# EasyEDA Pro project NAND-7S.eprj, board PCB1
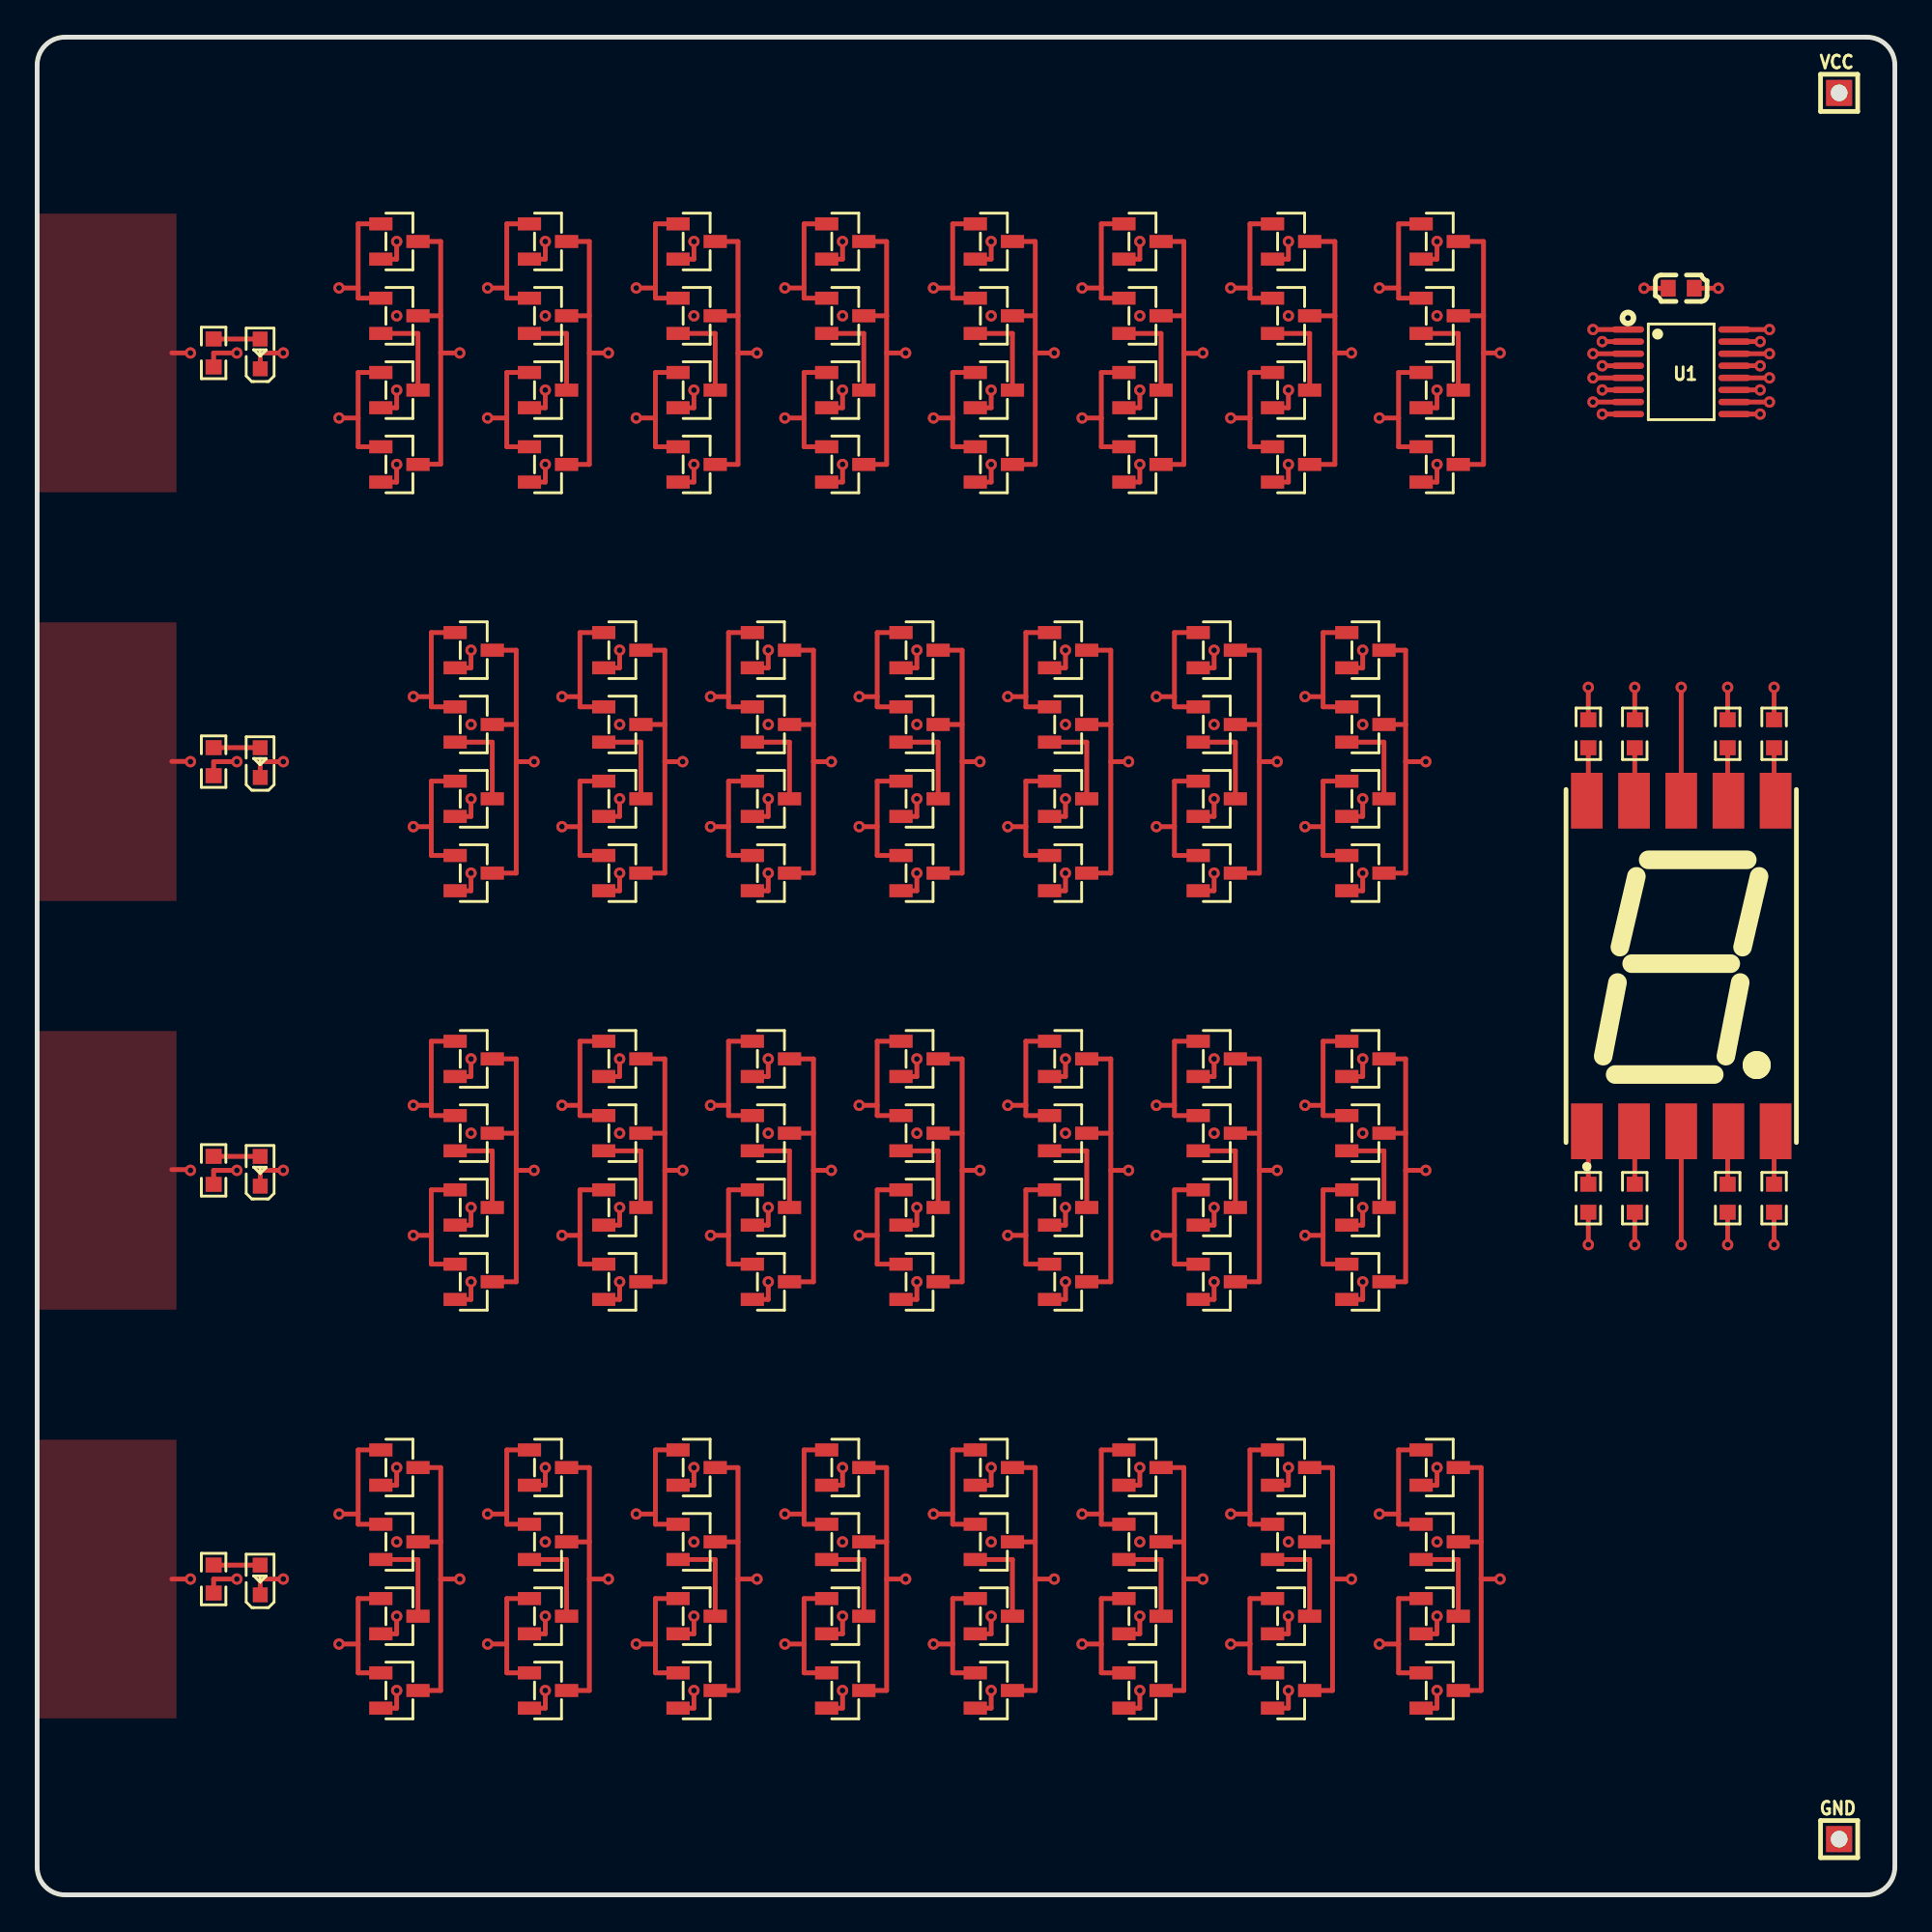
[diagram p1: board, top side]
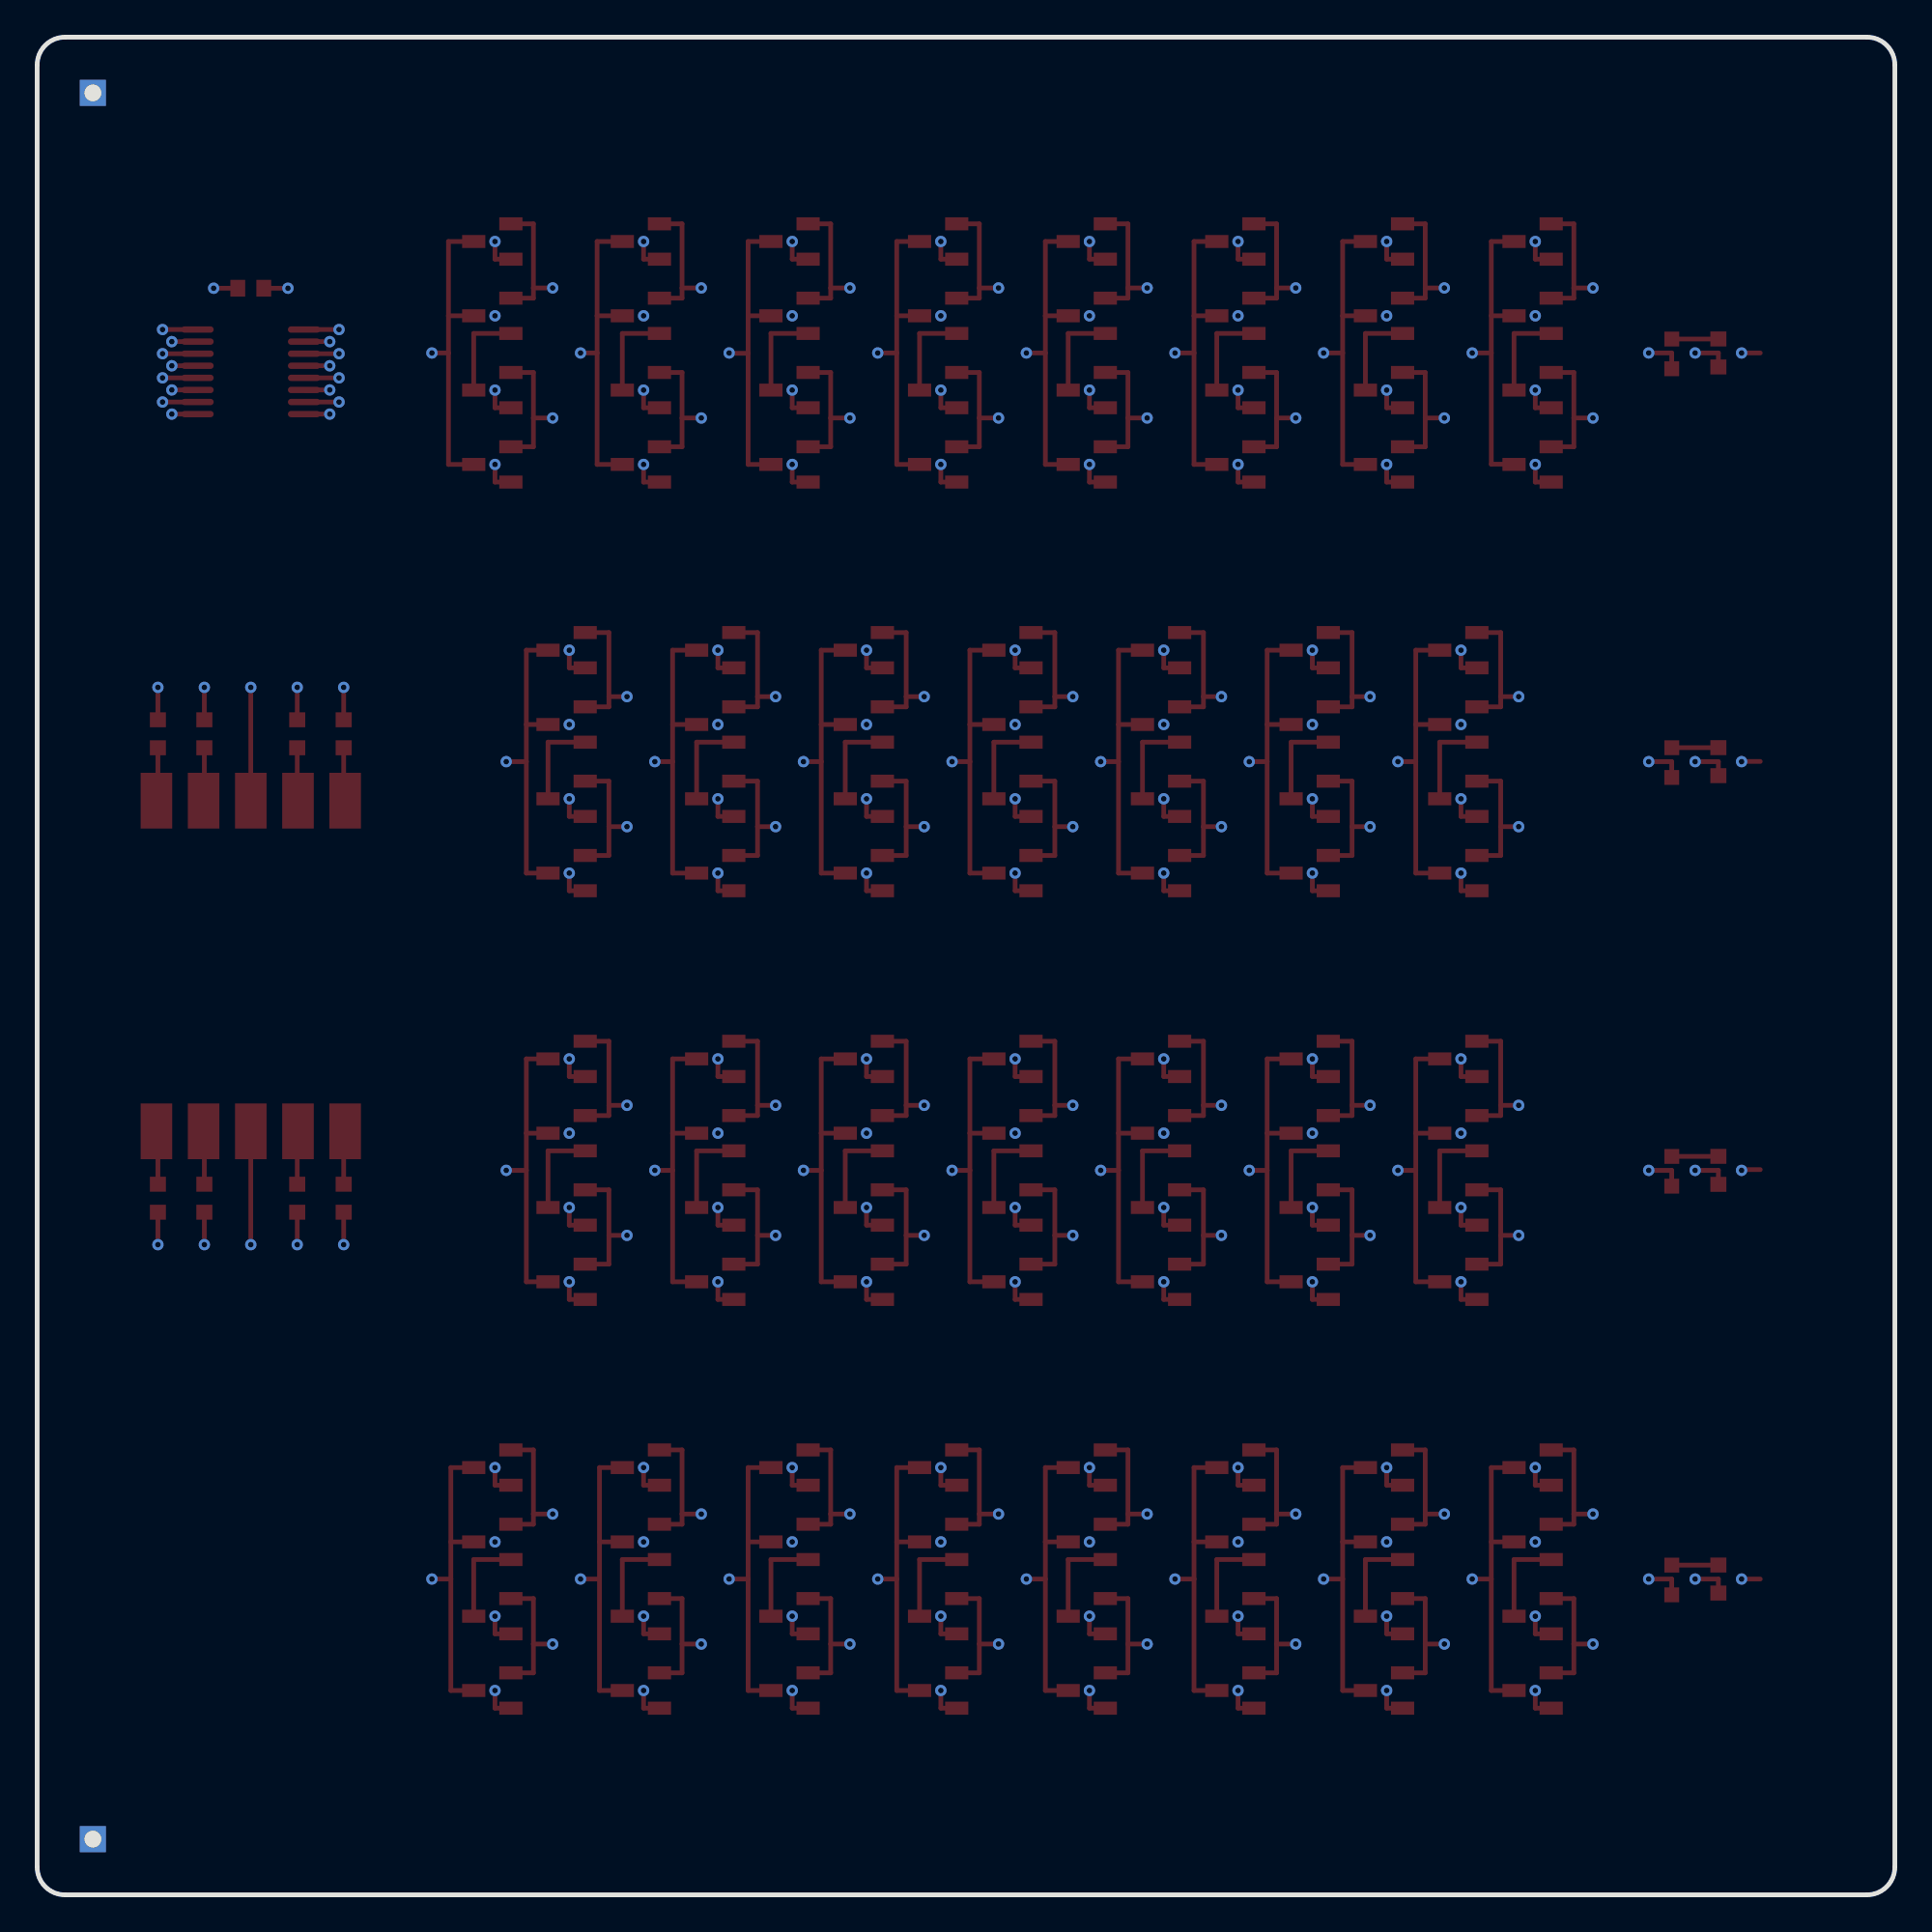
[diagram p2: board, bottom side, seen from below]

Outline 100 x 100 mm; copper layers: Top Layer, Inner1, Inner2, Inner3, Inner4, Bottom Layer. Coordinates in mm from the lower left corner of the outline.
Outline path: 0,98.5 0,1.5 arc(0.44,0.44) 1.5,0 98.5,0 arc(99.56,0.44) 100,1.5 100,98.5 arc(99.56,99.56) 98.5,100 1.5,100 arc(0.44,99.56) 0,98.5
Stack: Top Layer 0.035mm 外层铜厚1oz / Dielectric1 0.0994mm 3313 RC57% 4.2mil / Inner1 0.0152mm 内层铜厚 / Dielectric2 0.55mm 0.55mm H/H No copper / Inner2 0.0152mm 内层铜厚 / Dielectric3 0.1088mm 2116 RC54% 4.9mil / Inner3 0.0152mm 内层铜厚 / Dielectric4 0.55mm 0.55mm H/H No copper / Inner4 0.0152mm 内层铜厚 / Dielectric5 0.0994mm 3313 RC57% 4.2mil / Bottom Layer 0.035mm 外层铜厚1oz

## Design rules (mm)
template: JLCPCB Capability(Two Layers Board)
spacing copperThickness1oz (default): track to track 0.102, other pairs 0.152 to 0.3
spacing copperThickness2oz: track to track 0.203, other pairs 0.152 to 0.3
track width copperThickness1oz (default): min 0.127, default 0.254, max 2.54
track width copperThickness2oz: min 0.203, default 0.254, max 2.54
differential pair differentialPair (default): width min 0.127, default 0.254, max 2.54; gap min 0.152, default 0.152
via viaSize (default): diameter min 0.5, default 0.61, max 10; hole min 0.3, default 0.305, max 6.3

## Placement (name value [footprint] x y rotation side)
C1  100nF  [C0603]  88.5 86.48 180 top
GND  GND  [HDR-TH_1P-V-M_XKB_X4611WV-01I-C28D40]  97 3 0 top
LED1  -  [LED_0603]  12 83 90 top
LED2  -  [LED_0603]  12 61 90 top
LED3  -  [LED_0603]  12 39 90 top
LED4  -  [LED_0603]  12 17 90 top
N1-1  CJ2304  [SOT-23-3_L2.9-W1.3-P1.90-LS2.4-BR]  19.5 85 180 top
N1-2  CJ2304  [SOT-23-3_L2.9-W1.3-P1.90-LS2.4-BR]  19.5 81 180 top
N2-1  CJ2304  [SOT-23-3_L2.9-W1.3-P1.90-LS2.4-BR]  19.5 19 180 top
N2-2  CJ2304  [SOT-23-3_L2.9-W1.3-P1.90-LS2.4-BR]  19.5 15 180 top
N3-1  CJ2304  [SOT-23-3_L2.9-W1.3-P1.90-LS2.4-BR]  23.5 63 180 top
N3-2  CJ2304  [SOT-23-3_L2.9-W1.3-P1.90-LS2.4-BR]  23.5 59 180 top
N4-1  CJ2304  [SOT-23-3_L2.9-W1.3-P1.90-LS2.4-BR]  23.5 41 180 top
N4-2  CJ2304  [SOT-23-3_L2.9-W1.3-P1.90-LS2.4-BR]  23.5 37 180 top
N5-1  CJ2304  [SOT-23-3_L2.9-W1.3-P1.90-LS2.4-BR]  27.5 85 180 top
N5-2  CJ2304  [SOT-23-3_L2.9-W1.3-P1.90-LS2.4-BR]  27.5 81 180 top
N6-1  CJ2304  [SOT-23-3_L2.9-W1.3-P1.90-LS2.4-BR]  27.5 19 180 top
N6-2  CJ2304  [SOT-23-3_L2.9-W1.3-P1.90-LS2.4-BR]  27.5 15 180 top
N7-1  CJ2304  [SOT-23-3_L2.9-W1.3-P1.90-LS2.4-BR]  31.5 63 180 top
N7-2  CJ2304  [SOT-23-3_L2.9-W1.3-P1.90-LS2.4-BR]  31.5 59 180 top
N8-1  CJ2304  [SOT-23-3_L2.9-W1.3-P1.90-LS2.4-BR]  31.5 41 180 top
N8-2  CJ2304  [SOT-23-3_L2.9-W1.3-P1.90-LS2.4-BR]  31.5 37 180 top
N9-1  CJ2304  [SOT-23-3_L2.9-W1.3-P1.90-LS2.4-BR]  35.5 85 180 top
N9-2  CJ2304  [SOT-23-3_L2.9-W1.3-P1.90-LS2.4-BR]  35.5 81 180 top
N10-1  CJ2304  [SOT-23-3_L2.9-W1.3-P1.90-LS2.4-BR]  35.5 19 180 top
N10-2  CJ2304  [SOT-23-3_L2.9-W1.3-P1.90-LS2.4-BR]  35.5 15 180 top
N11-1  CJ2304  [SOT-23-3_L2.9-W1.3-P1.90-LS2.4-BR]  39.5 63 180 top
N11-2  CJ2304  [SOT-23-3_L2.9-W1.3-P1.90-LS2.4-BR]  39.5 59 180 top
N12-1  CJ2304  [SOT-23-3_L2.9-W1.3-P1.90-LS2.4-BR]  39.5 41 180 top
N12-2  CJ2304  [SOT-23-3_L2.9-W1.3-P1.90-LS2.4-BR]  39.5 37 180 top
N13-1  CJ2304  [SOT-23-3_L2.9-W1.3-P1.90-LS2.4-BR]  43.5 85 180 top
N13-2  CJ2304  [SOT-23-3_L2.9-W1.3-P1.90-LS2.4-BR]  43.5 81 180 top
N14-1  CJ2304  [SOT-23-3_L2.9-W1.3-P1.90-LS2.4-BR]  43.5 19 180 top
N14-2  CJ2304  [SOT-23-3_L2.9-W1.3-P1.90-LS2.4-BR]  43.5 15 180 top
N15-1  CJ2304  [SOT-23-3_L2.9-W1.3-P1.90-LS2.4-BR]  47.5 63 180 top
N15-2  CJ2304  [SOT-23-3_L2.9-W1.3-P1.90-LS2.4-BR]  47.5 59 180 top
N16-1  CJ2304  [SOT-23-3_L2.9-W1.3-P1.90-LS2.4-BR]  47.5 41 180 top
N16-2  CJ2304  [SOT-23-3_L2.9-W1.3-P1.90-LS2.4-BR]  47.5 37 180 top
N17-1  CJ2304  [SOT-23-3_L2.9-W1.3-P1.90-LS2.4-BR]  51.5 85 180 top
N17-2  CJ2304  [SOT-23-3_L2.9-W1.3-P1.90-LS2.4-BR]  51.5 81 180 top
N18-1  CJ2304  [SOT-23-3_L2.9-W1.3-P1.90-LS2.4-BR]  51.5 19 180 top
N18-2  CJ2304  [SOT-23-3_L2.9-W1.3-P1.90-LS2.4-BR]  51.5 15 180 top
N19-1  CJ2304  [SOT-23-3_L2.9-W1.3-P1.90-LS2.4-BR]  55.5 63 180 top
N19-2  CJ2304  [SOT-23-3_L2.9-W1.3-P1.90-LS2.4-BR]  55.5 59 180 top
N20-1  CJ2304  [SOT-23-3_L2.9-W1.3-P1.90-LS2.4-BR]  55.5 41 180 top
N20-2  CJ2304  [SOT-23-3_L2.9-W1.3-P1.90-LS2.4-BR]  55.5 37 180 top
N21-1  CJ2304  [SOT-23-3_L2.9-W1.3-P1.90-LS2.4-BR]  59.5 85 180 top
N21-2  CJ2304  [SOT-23-3_L2.9-W1.3-P1.90-LS2.4-BR]  59.5 81 180 top
N22-1  CJ2304  [SOT-23-3_L2.9-W1.3-P1.90-LS2.4-BR]  59.5 19 180 top
N22-2  CJ2304  [SOT-23-3_L2.9-W1.3-P1.90-LS2.4-BR]  59.5 15 180 top
N23-1  CJ2304  [SOT-23-3_L2.9-W1.3-P1.90-LS2.4-BR]  63.5 63 180 top
N23-2  CJ2304  [SOT-23-3_L2.9-W1.3-P1.90-LS2.4-BR]  63.5 59 180 top
N24-1  CJ2304  [SOT-23-3_L2.9-W1.3-P1.90-LS2.4-BR]  63.5 41 180 top
N24-2  CJ2304  [SOT-23-3_L2.9-W1.3-P1.90-LS2.4-BR]  63.5 37 180 top
N25-1  CJ2304  [SOT-23-3_L2.9-W1.3-P1.90-LS2.4-BR]  67.5 85 180 top
N25-2  CJ2304  [SOT-23-3_L2.9-W1.3-P1.90-LS2.4-BR]  67.5 81 180 top
N26-1  CJ2304  [SOT-23-3_L2.9-W1.3-P1.90-LS2.4-BR]  67.5 19 180 top
N26-2  CJ2304  [SOT-23-3_L2.9-W1.3-P1.90-LS2.4-BR]  67.5 15 180 top
N27-1  CJ2304  [SOT-23-3_L2.9-W1.3-P1.90-LS2.4-BR]  71.5 63 180 top
N27-2  CJ2304  [SOT-23-3_L2.9-W1.3-P1.90-LS2.4-BR]  71.5 59 180 top
N28-1  CJ2304  [SOT-23-3_L2.9-W1.3-P1.90-LS2.4-BR]  71.5 41 180 top
N28-2  CJ2304  [SOT-23-3_L2.9-W1.3-P1.90-LS2.4-BR]  71.5 37 180 top
N29-1  CJ2304  [SOT-23-3_L2.9-W1.3-P1.90-LS2.4-BR]  75.5 85 180 top
N29-2  CJ2304  [SOT-23-3_L2.9-W1.3-P1.90-LS2.4-BR]  75.5 81 180 top
N30-1  CJ2304  [SOT-23-3_L2.9-W1.3-P1.90-LS2.4-BR]  75.5 19 180 top
N30-2  CJ2304  [SOT-23-3_L2.9-W1.3-P1.90-LS2.4-BR]  75.5 15 180 top
P1-1  LP2301LT1G  [SOT-23-3_L2.9-W1.3-P1.90-LS2.4-BR]  19.5 89 180 top
P1-2  LP2301LT1G  [SOT-23-3_L2.9-W1.3-P1.90-LS2.4-BR]  19.5 77 180 top
P2-1  LP2301LT1G  [SOT-23-3_L2.9-W1.3-P1.90-LS2.4-BR]  19.5 23 180 top
P2-2  LP2301LT1G  [SOT-23-3_L2.9-W1.3-P1.90-LS2.4-BR]  19.5 11 180 top
P3-1  LP2301LT1G  [SOT-23-3_L2.9-W1.3-P1.90-LS2.4-BR]  23.5 67 180 top
P3-2  LP2301LT1G  [SOT-23-3_L2.9-W1.3-P1.90-LS2.4-BR]  23.5 55 180 top
P4-1  LP2301LT1G  [SOT-23-3_L2.9-W1.3-P1.90-LS2.4-BR]  23.5 45 180 top
P4-2  LP2301LT1G  [SOT-23-3_L2.9-W1.3-P1.90-LS2.4-BR]  23.5 33 180 top
P5-1  LP2301LT1G  [SOT-23-3_L2.9-W1.3-P1.90-LS2.4-BR]  27.5 89 180 top
P5-2  LP2301LT1G  [SOT-23-3_L2.9-W1.3-P1.90-LS2.4-BR]  27.5 77 180 top
P6-1  LP2301LT1G  [SOT-23-3_L2.9-W1.3-P1.90-LS2.4-BR]  27.5 23 180 top
P6-2  LP2301LT1G  [SOT-23-3_L2.9-W1.3-P1.90-LS2.4-BR]  27.5 11 180 top
P7-1  LP2301LT1G  [SOT-23-3_L2.9-W1.3-P1.90-LS2.4-BR]  31.5 67 180 top
P7-2  LP2301LT1G  [SOT-23-3_L2.9-W1.3-P1.90-LS2.4-BR]  31.5 55 180 top
P8-1  LP2301LT1G  [SOT-23-3_L2.9-W1.3-P1.90-LS2.4-BR]  31.5 45 180 top
P8-2  LP2301LT1G  [SOT-23-3_L2.9-W1.3-P1.90-LS2.4-BR]  31.5 33 180 top
P9-1  LP2301LT1G  [SOT-23-3_L2.9-W1.3-P1.90-LS2.4-BR]  35.5 89 180 top
P9-2  LP2301LT1G  [SOT-23-3_L2.9-W1.3-P1.90-LS2.4-BR]  35.5 77 180 top
P10-1  LP2301LT1G  [SOT-23-3_L2.9-W1.3-P1.90-LS2.4-BR]  35.5 23 180 top
P10-2  LP2301LT1G  [SOT-23-3_L2.9-W1.3-P1.90-LS2.4-BR]  35.5 11 180 top
P11-1  LP2301LT1G  [SOT-23-3_L2.9-W1.3-P1.90-LS2.4-BR]  39.5 67 180 top
P11-2  LP2301LT1G  [SOT-23-3_L2.9-W1.3-P1.90-LS2.4-BR]  39.5 55 180 top
P12-1  LP2301LT1G  [SOT-23-3_L2.9-W1.3-P1.90-LS2.4-BR]  39.5 45 180 top
P12-2  LP2301LT1G  [SOT-23-3_L2.9-W1.3-P1.90-LS2.4-BR]  39.5 33 180 top
P13-1  LP2301LT1G  [SOT-23-3_L2.9-W1.3-P1.90-LS2.4-BR]  43.5 89 180 top
P13-2  LP2301LT1G  [SOT-23-3_L2.9-W1.3-P1.90-LS2.4-BR]  43.5 77 180 top
P14-1  LP2301LT1G  [SOT-23-3_L2.9-W1.3-P1.90-LS2.4-BR]  43.5 23 180 top
P14-2  LP2301LT1G  [SOT-23-3_L2.9-W1.3-P1.90-LS2.4-BR]  43.5 11 180 top
P15-1  LP2301LT1G  [SOT-23-3_L2.9-W1.3-P1.90-LS2.4-BR]  47.5 67 180 top
P15-2  LP2301LT1G  [SOT-23-3_L2.9-W1.3-P1.90-LS2.4-BR]  47.5 55 180 top
P16-1  LP2301LT1G  [SOT-23-3_L2.9-W1.3-P1.90-LS2.4-BR]  47.5 45 180 top
P16-2  LP2301LT1G  [SOT-23-3_L2.9-W1.3-P1.90-LS2.4-BR]  47.5 33 180 top
P17-1  LP2301LT1G  [SOT-23-3_L2.9-W1.3-P1.90-LS2.4-BR]  51.5 89 180 top
P17-2  LP2301LT1G  [SOT-23-3_L2.9-W1.3-P1.90-LS2.4-BR]  51.5 77 180 top
P18-1  LP2301LT1G  [SOT-23-3_L2.9-W1.3-P1.90-LS2.4-BR]  51.5 23 180 top
P18-2  LP2301LT1G  [SOT-23-3_L2.9-W1.3-P1.90-LS2.4-BR]  51.5 11 180 top
P19-1  LP2301LT1G  [SOT-23-3_L2.9-W1.3-P1.90-LS2.4-BR]  55.5 67 180 top
P19-2  LP2301LT1G  [SOT-23-3_L2.9-W1.3-P1.90-LS2.4-BR]  55.5 55 180 top
P20-1  LP2301LT1G  [SOT-23-3_L2.9-W1.3-P1.90-LS2.4-BR]  55.5 45 180 top
P20-2  LP2301LT1G  [SOT-23-3_L2.9-W1.3-P1.90-LS2.4-BR]  55.5 33 180 top
P21-1  LP2301LT1G  [SOT-23-3_L2.9-W1.3-P1.90-LS2.4-BR]  59.5 89 180 top
P21-2  LP2301LT1G  [SOT-23-3_L2.9-W1.3-P1.90-LS2.4-BR]  59.5 77 180 top
P22-1  LP2301LT1G  [SOT-23-3_L2.9-W1.3-P1.90-LS2.4-BR]  59.5 23 180 top
P22-2  LP2301LT1G  [SOT-23-3_L2.9-W1.3-P1.90-LS2.4-BR]  59.5 11 180 top
P23-1  LP2301LT1G  [SOT-23-3_L2.9-W1.3-P1.90-LS2.4-BR]  63.5 67 180 top
P23-2  LP2301LT1G  [SOT-23-3_L2.9-W1.3-P1.90-LS2.4-BR]  63.5 55 180 top
P24-1  LP2301LT1G  [SOT-23-3_L2.9-W1.3-P1.90-LS2.4-BR]  63.5 45 180 top
P24-2  LP2301LT1G  [SOT-23-3_L2.9-W1.3-P1.90-LS2.4-BR]  63.5 33 180 top
P25-1  LP2301LT1G  [SOT-23-3_L2.9-W1.3-P1.90-LS2.4-BR]  67.5 89 180 top
P25-2  LP2301LT1G  [SOT-23-3_L2.9-W1.3-P1.90-LS2.4-BR]  67.5 77 180 top
P26-1  LP2301LT1G  [SOT-23-3_L2.9-W1.3-P1.90-LS2.4-BR]  67.5 23 180 top
P26-2  LP2301LT1G  [SOT-23-3_L2.9-W1.3-P1.90-LS2.4-BR]  67.5 11 180 top
P27-1  LP2301LT1G  [SOT-23-3_L2.9-W1.3-P1.90-LS2.4-BR]  71.5 67 180 top
P27-2  LP2301LT1G  [SOT-23-3_L2.9-W1.3-P1.90-LS2.4-BR]  71.5 55 180 top
P28-1  LP2301LT1G  [SOT-23-3_L2.9-W1.3-P1.90-LS2.4-BR]  71.5 45 180 top
P28-2  LP2301LT1G  [SOT-23-3_L2.9-W1.3-P1.90-LS2.4-BR]  71.5 33 180 top
P29-1  LP2301LT1G  [SOT-23-3_L2.9-W1.3-P1.90-LS2.4-BR]  75.5 89 180 top
P29-2  LP2301LT1G  [SOT-23-3_L2.9-W1.3-P1.90-LS2.4-BR]  75.5 77 180 top
P30-1  LP2301LT1G  [SOT-23-3_L2.9-W1.3-P1.90-LS2.4-BR]  75.5 23 180 top
P30-2  LP2301LT1G  [SOT-23-3_L2.9-W1.3-P1.90-LS2.4-BR]  75.5 11 180 top
R1  470  [R0603]  9.5 83 90 top
R2  470  [R0603]  9.5 61 90 top
R3  470  [R0603]  9.5 39 90 top
R4  470  [R0603]  9.5 17 90 top
R5  470  [R0603]  83.5 37.5 90 top
R6  470  [R0603]  86 37.5 90 top
R8  470  [R0603]  91 37.5 90 top
R9  470  [R0603]  93.5 37.5 90 top
R10  470  [R0603]  93.5 62.5 90 top
R11  470  [R0603]  91 62.5 90 top
R13  470  [R0603]  86 62.5 90 top
R14  470  [R0603]  83.5 62.5 90 top
U1  TTP224  [TSSOP-16_L5.0-W4.4-P0.65-LS6.4-BL]  88.5 81.98 270 top
U2  GS5611CR-G  [LED-SEG-SMD_GS5611CR-G]  88.5 50 0 top
VCC  VCC  [HDR-TH_1P-V-M_XKB_X4611WV-01I-C28D40]  97 97 0 top

## Footprints (pads in the part's own frame, mm; a bottom-side part is the same pattern mirrored in y, then rotated)
C0603
  rect 0.8x0.9 smd: 1(-0.7,0) 2(0.7,0)
HDR-TH_1P-V-M_XKB_X4611WV-01I-C28D40
  rect 1.4x1.4 hole 0.9: 1(0,0)
LED-SEG-SMD_GS5611CR-G
  rect 1.7x3 smd: 1(-5.08,-8.9) 2(-2.54,-8.9) 3(0,-8.9) 4(2.54,-8.9) 5(5.08,-8.9) 6(5.08,8.9) 7(2.54,8.9) 8(0,8.9) 9(-2.54,8.9) 10(-5.08,8.9)
LED_0603
  rect 0.8x0.8 smd: 1(-0.851,-0.01) 2(0.75,-0.005)
R0603
  rect 0.806x0.864 smd: 1(-0.753,0) 2(0.753,0)
SOT-23-3_L2.9-W1.3-P1.90-LS2.4-BR
  rect 1.25x0.7 smd: 1(1,-0.95) 2(1,0.95) 3(-1,0)
TSSOP-16_L5.0-W4.4-P0.65-LS6.4-BL
  oval 0.343x1.732 smd: 1(-2.276,-2.865) 2(-1.625,-2.865) 3(-0.976,-2.865) 4(-0.325,-2.865) 5(0.325,-2.865) 6(0.976,-2.865) 7(1.625,-2.865) 8(2.276,-2.865) 9(2.276,2.865) 10(1.625,2.865) 11(0.976,2.865) 12(0.325,2.865) 13(-0.325,2.865) 14(-0.976,2.865) 15(-1.625,2.865) 16(-2.276,2.865)

## Nets
As in the schematic.

## Via types
v1: diameter 0.61, hole 0.305, Top Layer to Bottom Layer, 250 vias

## Routing (per net, layer and track width the routed paths; a pad name or vN(x,y) marks a point on that pad's centre or on a via; arc(x,y) is an arc through that point)
GND: length 507.4
  Top Layer w0.254: v1(19.36,81) 19.36,80.05 N1-2.2 ; v1(31.36,37) 31.36,36.05 N8-2.2 ; v1(39.36,37) 39.36,36.05 N12-2.2 ; N10-2.2 35.36,14.05 v1(35.36,15) ; v1(47.36,59) 47.36,58.05 N15-2.2 ; v1(63.36,59) 63.36,58.05 N23-2.2 ; v1(55.36,37) 55.36,36.05 N20-2.2 ; N22-2.2 59.36,14.05 v1(59.36,15) ; v1(13.25,17) 12.01,17 LED4.1 ; v1(23.36,59) 23.36,58.05 N3-2.2 ; N6-2.2 27.36,14.05 v1(27.36,15) ; v1(13.25,39) 12.01,39 LED3.1 ; v1(55.36,59) 55.36,58.05 N19-2.2 ; v1(13.25,61) 12.01,61 LED2.1 ; N18-2.2 51.36,14.05 v1(51.36,15) ; LED1.1 12.01,83 v1(13.25,83) ; v1(47.36,37) 47.36,36.05 N16-2.2 ; v1(92.75,79.71) U1.9 ; v1(75.36,15) 75.36,14.05 N30-2.2 ; N17-2.2 51.35,80.05 v1(51.35,81) ; N11-2.2 39.36,58.05 v1(39.36,59) ; v1(83.75,80.36) U1.7 ; N27-2.2 71.36,58.05 v1(71.36,59) ; N7-2.2 31.36,58.05 v1(31.36,59) ; v1(43.36,81) 43.36,80.05 N13-2.2 ; N29-2.2 75.36,80.05 v1(75.36,81) ; v1(67.36,81) 67.36,80.05 N25-2.2 ; v1(59.36,81) 59.36,80.05 N21-2.2 ; N5-2.2 27.36,80.05 v1(27.36,81) ; v1(92.75,81.01) U1.11 ; v1(88.5,65) U2.8 ; v1(19.36,15) 19.36,14.05 N2-2.2 ; v1(63.36,37) 63.36,36.05 N24-2.2 ; N26-2.2 67.35,14.05 v1(67.35,15) ; v1(35.36,81) 35.36,80.05 N9-2.2 ; v1(88.5,35) U2.3 ; v1(71.36,37) 71.36,36.05 N28-2.2 ; N4-2.2 23.36,36.05 v1(23.36,37) ; v1(86.5,86.48) C1.2 ; v1(93.25,80.36) U1.10 ; v1(43.36,15) 43.36,14.05 N14-2.2 ; v1(84.25,79.71) U1.8
  Inner1 w0.254: v1(88.5,35) 88.5,3 GND.1 ; v1(75.36,81) 75.36,80.36 v1(83.75,80.36) 86.5,80.36 v1(86.5,86.48)
  Inner2 w0.254: 88.5,79.71 v1(84.25,79.71) 83.75,79.71 v1(83.75,80.36) ; 88.5,79.71 v1(88.5,65) v1(88.5,35) ; 88.5,79.71 v1(92.75,79.71) 93.25,79.71 v1(93.25,80.36) 93.25,81.01 v1(92.75,81.01)
  Inner4 w0.254: v1(75.36,15) v1(67.35,15) v1(59.36,15) v1(51.36,15) v1(43.36,15) v1(35.36,15) v1(27.36,15) ; 15.5,81 15.5,83 v1(13.25,83) ; 15.5,81 15.5,61 ; 15.5,81 v1(19.36,81) v1(27.36,81) v1(35.36,81) v1(43.36,81) v1(51.35,81) v1(59.36,81) v1(67.36,81) v1(75.36,81) ; 15.5,59 v1(23.36,59) v1(31.36,59) v1(39.36,59) v1(47.36,59) v1(55.36,59) v1(63.36,59) v1(71.36,59) ; 15.5,59 15.5,61 ; 15.5,59 15.5,39 ; 15.5,37 15.5,17 ; 15.5,37 v1(23.36,37) v1(31.36,37) v1(39.36,37) v1(47.36,37) v1(55.36,37) v1(63.36,37) v1(71.36,37) ; 15.5,37 15.5,39 ; 15.5,17 v1(13.25,17) ; 15.5,17 15.5,15 v1(19.36,15) 27.35,15 ; 15.5,39 v1(13.25,39) ; v1(13.25,61) 15.5,61
VCC: length 752.5
  Top Layer w0.254: v1(39.36,55) 39.36,54.05 P11-2.2 ; P3-1.2 23.36,66.05 v1(23.36,67) ; v1(39.36,33) 39.36,32.05 P12-2.2 ; P7-2.2 31.36,54.05 v1(31.36,55) ; v1(55.36,55) 55.36,54.05 P19-2.2 ; P10-2.2 35.36,10.05 v1(35.36,11) ; P3-2.2 23.36,54.05 v1(23.36,55) ; v1(27.36,89) 27.36,88.05 P5-1.2 ; P18-1.2 51.36,22.05 v1(51.36,23) ; v1(83.75,81.66) U1.5 ; P18-2.2 51.35,10.05 v1(51.35,11) ; v1(71.36,67) 71.36,66.05 P27-1.2 ; v1(71.36,45) 71.36,44.05 P28-1.2 ; v1(31.36,67) 31.36,66.05 P7-1.2 ; P4-1.2 23.36,44.05 v1(23.36,45) ; P20-1.2 55.36,44.05 v1(55.36,45) ; P2-1.2 19.36,22.05 v1(19.36,23) ; v1(63.36,55) 63.36,54.05 P23-2.2 ; P9-2.2 35.36,76.05 v1(35.36,77) ; P16-2.2 47.36,32.05 v1(47.36,33) ; P29-1.2 75.36,88.05 v1(75.36,89) ; v1(35.36,23) 35.36,22.05 P10-1.2 ; v1(67.35,11) 67.35,10.05 P26-2.2 ; P22-1.2 59.36,22.05 v1(59.36,23) ; v1(27.36,23) 27.36,22.05 P6-1.2 ; P15-1.2 47.36,66.05 v1(47.36,67) ; P30-1.2 75.36,22.05 v1(75.36,23) ; v1(51.36,89) 51.36,88.05 P17-1.2 ; v1(71.36,55) 71.36,54.05 P27-2.2 ; P9-1.2 35.36,88.05 v1(35.36,89) ; P1-2.2 19.36,76.05 v1(19.36,77) ; P21-2.2 59.36,76.05 v1(59.36,77) ; P12-1.2 39.36,44.05 v1(39.36,45) ; P6-2.2 27.36,10.05 v1(27.36,11) ; v1(67.36,77) 67.36,76.05 P25-2.2 ; v1(55.36,33) 55.36,32.05 P20-2.2 ; P13-2.2 43.36,76.05 v1(43.36,77) ; P2-2.2 19.36,10.05 v1(19.36,11) ; v1(27.36,77) 27.36,76.05 P5-2.2 ; P24-1.2 63.36,44.05 v1(63.36,45) ; P15-2.2 47.36,54.05 v1(47.36,55) ; v1(31.36,33) 31.36,32.05 P8-2.2 ; v1(43.36,89) 43.36,88.05 P13-1.2 ; v1(71.36,33) 71.36,32.05 P28-2.2 ; v1(67.36,89) 67.36,88.05 P25-1.2 ; P11-1.2 39.36,66.05 v1(39.36,67) ; v1(23.36,33) 23.36,32.05 P4-2.2 ; P29-2.2 75.36,76.05 v1(75.36,77) ; P23-1.2 63.36,66.05 v1(63.36,67) ; P24-2.2 63.36,32.05 v1(63.36,33) ; P14-1.2 43.36,22.05 v1(43.36,23) ; v1(93.25,81.66) U1.12 ; v1(47.36,45) 47.36,44.05 P16-1.2 ; P30-2.2 75.36,10.05 v1(75.36,11) ; P1-1.2 19.36,88.05 v1(19.36,89) ; v1(59.36,11) 59.36,10.05 P22-2.2 ; v1(93.5,35) R9.1 ; v1(67.36,23) 67.36,22.05 P26-1.2 ; v1(43.36,11) 43.36,10.05 P14-2.2 ; P21-1.2 59.36,88.05 v1(59.36,89) ; v1(84.25,81.01) U1.6 ; v1(31.36,45) 31.36,44.05 P8-1.2 ; P19-1.2 55.36,66.05 v1(55.36,67) ; v1(51.36,77) 51.36,76.05 P17-2.2 ; v1(90.5,86.48) C1.1
  Inner1 w0.254: VCC.1 88.5,97 88.5,86.48 v1(90.5,86.48)
  Inner2 w0.254: v1(90.5,86.48) 88.65,86.48 ; 88.5,81.66 v1(83.75,81.66) 83.75,81.01 v1(84.25,81.01) ; 88.5,81.66 88.5,86.48 ; 88.5,81.66 v1(93.25,81.66) 95.13,81.66 95.13,35 v1(93.5,35)
  Inner4 w0.254: 79.51,23 v1(75.36,23) v1(67.36,23) v1(59.36,23) v1(51.36,23) v1(43.36,23) v1(35.36,23) v1(27.36,23) v1(19.36,23) ; 79.51,23 79.51,11 v1(75.36,11) v1(67.35,11) v1(59.36,11) v1(51.35,11) v1(43.36,11) v1(35.36,11) v1(27.36,11) v1(19.36,11) ; 79.51,23 79.51,33 ; 79.51,81.66 79.51,89 v1(75.36,89) v1(67.36,89) v1(59.36,89) v1(51.36,89) v1(43.36,89) v1(35.36,89) v1(27.36,89) v1(19.36,89) ; 79.51,81.66 v1(83.75,81.66) ; 79.51,81.66 79.51,77 ; 79.51,45 v1(71.36,45) v1(63.36,45) v1(55.36,45) v1(47.36,45) v1(39.36,45) v1(31.36,45) v1(23.36,45) ; 79.51,45 79.51,55 ; 79.51,45 79.51,33 ; v1(23.36,33) v1(31.36,33) v1(39.36,33) v1(47.36,33) v1(55.36,33) v1(63.36,33) v1(71.36,33) 79.51,33 ; 79.51,55 79.51,67 ; 79.51,55 v1(71.36,55) v1(63.36,55) v1(55.36,55) v1(47.36,55) v1(39.36,55) v1(31.36,55) v1(23.36,55) ; v1(23.36,67) v1(31.36,67) v1(39.36,67) v1(47.36,67) v1(55.36,67) v1(63.36,67) v1(71.36,67) 79.51,67 ; 79.51,67 79.51,77 ; 79.51,77 v1(75.36,77) v1(67.36,77) v1(59.36,77) v1(51.36,77) v1(43.36,77) v1(35.36,77) v1(27.36,77) v1(19.36,77)
(no net):
  vias: v1(19.36,85) v1(19.36,19) v1(23.36,63) v1(23.36,41) v1(27.36,85) v1(27.36,19) v1(31.36,63) v1(31.36,41) v1(35.36,85) v1(35.36,19) v1(39.36,63) v1(39.36,41) v1(43.36,85) v1(43.36,19) v1(47.36,63) v1(47.36,41) v1(51.36,85) v1(51.36,19) v1(55.36,63) v1(55.36,41) v1(59.36,85) v1(59.36,19) v1(63.36,63) v1(63.36,41) v1(67.36,85) v1(67.36,19) v1(71.36,63) v1(71.36,41) v1(75.36,85) v1(75.36,19)
A: length 2.9
  Top Layer w0.254: R11.1 91,58.94 U2.7
B: length 2.9
  Top Layer w0.254: U2.6 93.5,58.98 R10.1
C: length 2.9
  Top Layer w0.254: R8.2 91,41.06 U2.4
D: length 2.9
  Top Layer w0.254: U2.2 86,41.06 R6.2
E: length 2.9
  Top Layer w0.254: R5.2 83.5,41.02 U2.1
F: length 2.9
  Top Layer w0.254: R13.1 86,58.94 U2.9
G: length 2.9
  Top Layer w0.254: U2.10 83.5,58.98 R14.1
IN1: length 203.1
  Top Layer w0.254: v1(16.25,86.5) 17.28,86.5 ; 17.28,86.5 17.28,89.95 P1-1.1 ; 17.28,86.5 17.28,85.95 18.35,85.95 ; 17.28,20.5 17.28,23.95 P2-1.1 ; 17.28,20.5 v1(16.25,20.5) ; 17.28,20.5 17.28,19.95 18.35,19.95 ; P1-2.1 17.28,77.95 17.28,79.5 ; 17.28,79.5 17.28,81.95 18.35,81.95 ; 17.28,79.5 v1(16.25,79.5) ; R1.1 9.5,83 v1(10.75,83) ; v1(93.25,84.26) U1.16
  Inner1 w0.254: v1(16.25,86.5) v1(16.25,79.5) 10.75,79.5 v1(10.75,83)
  Inner2 w0.254: v1(16.25,20.5) v1(16.25,79.5)
  Inner3 w0.254: v1(10.75,83) 10.75,93.52 93.25,93.52 v1(93.25,84.26)
IN2: length 201.5
  Top Layer w0.254: P4-1.1 21.22,45.95 21.22,42.5 ; P6-1.1 25.28,23.95 25.28,20.5 ; 21.22,42.5 v1(20.25,42.5) ; 21.22,42.5 21.22,41.95 N4-1.1 ; v1(10.75,61) 9.5,61 R2.1 ; N6-1.1 25.28,19.95 25.28,20.5 ; 25.28,20.5 v1(24.25,20.5) ; v1(92.75,83.61) U1.15
  Inner1 w0.254: v1(10.75,61) 10.75,42.5 v1(20.25,42.5) 22.77,42.5 22.77,20.5 v1(24.25,20.5)
  Inner3 w0.254: v1(92.75,83.61) 92.82,83.68 93.86,83.68 93.86,94.16 10.12,94.16 10.12,61 v1(10.75,61)
IN3: length 263.4
  Top Layer w0.254: 18.35,15.95 17.28,15.95 17.28,13.5 ; v1(32.25,79.5) 33.28,79.5 ; 33.28,79.5 33.28,81.95 N9-2.1 ; 33.28,79.5 33.28,77.95 P9-2.1 ; 17.28,13.5 17.28,11.95 P2-2.1 ; 17.28,13.5 v1(16.25,13.5) ; R3.1 9.5,39 v1(10.75,39) ; v1(93.25,82.96) U1.14
  Inner3 w0.254: 17.28,40.06 17.28,13.5 v1(16.25,13.5) ; 17.28,40.06 17.28,72.57 32.25,72.57 v1(32.25,79.5) ; 17.28,40.06 10.75,40.06 v1(10.75,39) 9.5,39 9.5,94.79 94.5,94.79 94.5,82.96 v1(93.25,82.96)
IN4: length 372.8
  Top Layer w0.254: v1(20.25,57.5) 21.22,57.5 ; 21.22,57.5 21.22,59.95 N3-2.1 ; 21.22,57.5 21.22,55.95 P3-2.1 ; P25-2.1 65.28,77.95 65.28,79.5 ; 65.28,79.5 65.28,81.95 N25-2.1 ; 65.28,79.5 v1(64.25,79.5) ; R4.1 9.5,17 v1(10.75,17) ; 37.22,35.5 37.22,37.95 N12-2.1 ; 37.22,35.5 v1(36.25,35.5) ; 37.22,35.5 37.22,33.95 P12-2.1 ; P11-2.1 37.22,55.95 37.22,57.5 ; 33.28,13.5 33.28,11.95 P10-2.1 ; 33.28,13.5 33.28,15.95 N10-2.1 ; 33.28,13.5 v1(32.25,13.5) ; 37.22,57.5 37.22,59.95 N11-2.1 ; 37.22,57.5 v1(36.25,57.5) ; v1(92.75,82.31) U1.13
  Inner3 w0.254: 37.22,35.5 37.22,11.99 32.25,11.99 ; 37.22,35.5 v1(36.25,35.5) ; 37.22,35.5 37.22,55.93 ; v1(10.75,17) 8.88,17 ; 8.88,17 8.88,11.99 32.25,11.99 ; 8.88,17 8.88,95.43 95.13,95.43 95.13,82.38 92.82,82.38 v1(92.75,82.31) ; v1(20.25,57.5) 20.25,55.93 37.22,55.93 ; 37.22,55.93 37.22,57.5 ; v1(64.25,79.5) 64.27,79.48 64.27,72.57 37.22,72.57 37.22,57.5 ; 32.25,11.99 v1(32.25,13.5) ; 37.22,57.5 v1(36.25,57.5)
LED1: length 2.5
  Top Layer w0.254: R1.2 9.5,83.75 LED1.2
LED2: length 2.5
  Top Layer w0.254: LED2.2 12,61.75 R2.2
LED3: length 2.5
  Top Layer w0.254: R3.2 9.5,39.75 LED3.2
LED4: length 2.5
  Top Layer w0.254: R4.2 9.5,17.75 LED4.2
NAND1: length 5
  Top Layer w0.254: N1-2.3 20.5,84.05 N1-1.2
NAND2: length 5.1
  Top Layer w0.254: N2-1.2 20.5,18.05 N2-2.3
NAND3: length 5
  Top Layer w0.254: N3-1.2 24.5,62.05 N3-2.3
NAND4: length 5
  Top Layer w0.254: N4-2.3 24.5,40.05 N4-1.2
NAND5: length 5
  Top Layer w0.254: N5-1.2 28.5,84.05 N5-2.3
NAND6: length 5.1
  Top Layer w0.254: N6-2.3 28.5,18.05 N6-1.2
NAND7: length 5
  Top Layer w0.254: N7-1.2 32.5,62.05 N7-2.3
NAND8: length 5
  Top Layer w0.254: N8-2.3 32.5,40.05 N8-1.2
NAND9: length 5
  Top Layer w0.254: N9-1.2 36.5,84.05 N9-2.3
NAND10: length 5.1
  Top Layer w0.254: N10-1.2 36.5,18.05 N10-2.3
NAND11: length 5
  Top Layer w0.254: N11-2.3 40.5,62.05 N11-1.2
NAND12: length 5
  Top Layer w0.254: N12-2.3 40.5,40.05 N12-1.2
NAND13: length 5
  Top Layer w0.254: N13-2.3 44.5,84.05 N13-1.2
NAND14: length 5.1
  Top Layer w0.254: N14-1.2 44.5,18.05 N14-2.3
NAND15: length 5
  Top Layer w0.254: N15-1.2 48.5,62.05 N15-2.3
NAND16: length 5
  Top Layer w0.254: N16-1.2 48.5,40.05 N16-2.3
NAND17: length 5
  Top Layer w0.254: N17-1.2 52.5,84.05 N17-2.3
NAND18: length 5.1
  Top Layer w0.254: N18-1.2 52.5,18.05 N18-2.3
NAND19: length 5
  Top Layer w0.254: N19-1.2 56.5,62.05 N19-2.3
NAND20: length 5
  Top Layer w0.254: N20-2.3 56.5,40.05 N20-1.2
NAND21: length 5
  Top Layer w0.254: N21-1.2 60.5,84.05 N21-2.3
NAND22: length 5.1
  Top Layer w0.254: N22-2.3 60.5,18.05 N22-1.2
NAND23: length 5
  Top Layer w0.254: N23-2.3 64.5,62.05 N23-1.2
NAND24: length 5
  Top Layer w0.254: N24-1.2 64.5,40.05 N24-2.3
NAND25: length 5
  Top Layer w0.254: N25-2.3 68.5,84.05 N25-1.2
NAND26: length 5.1
  Top Layer w0.254: N26-2.3 68.5,18.05 N26-1.2
NAND27: length 5
  Top Layer w0.254: N27-2.3 72.5,62.05 N27-1.2
NAND28: length 5
  Top Layer w0.254: N28-1.2 72.5,40.05 N28-2.3
NAND29: length 5
  Top Layer w0.254: N29-2.3 76.5,84.05 N29-1.2
NAND30: length 5.1
  Top Layer w0.254: N30-1.2 76.5,18.05 N30-2.3
OUT-1-1: length 164.6
  Top Layer w0.254: 21.72,85 21.72,89 P1-1.3 ; 21.72,85 21.72,83 ; 21.72,85 20.65,85 ; 21.22,64.5 21.22,67.95 P3-1.1 ; 21.22,64.5 v1(20.25,64.5) ; 21.22,64.5 21.22,63.95 N3-1.1 ; P26-1.1 65.28,23.95 65.28,20.5 ; 65.28,20.5 65.28,19.95 N26-1.1 ; 65.28,20.5 v1(64.25,20.5) ; v1(44.25,42.5) 45.22,42.5 ; 45.22,42.5 45.22,41.95 N16-1.1 ; 45.22,42.5 45.22,45.95 P16-1.1 ; 21.72,83 21.72,77.01 20.51,77.01 P1-2.3 ; 21.72,83 v1(22.75,83)
  Inner1 w0.254: v1(22.75,83) 20.25,83 v1(20.25,64.5)
  Inner2 w0.254: v1(44.25,42.5) 45.22,42.5 45.22,36.08 ; 45.22,36.08 25.79,36.08 25.79,64.5 v1(20.25,64.5) ; 45.22,36.08 45.22,15.93 64.25,15.93 v1(64.25,20.5)
OUT-1-2: length 111.5
  Top Layer w0.254: P2-2.3 21.72,11 21.72,17 ; 25.28,86.5 25.28,89.95 P5-1.1 ; 25.28,86.5 25.28,85.95 N5-1.1 ; 25.28,86.5 v1(24.25,86.5) ; P2-1.3 21.72,23 21.72,19 ; 20.65,19 21.72,19 ; 21.72,19 21.72,17 ; P4-2.1 21.22,33.95 21.22,35.5 ; 21.72,17 v1(22.75,17) ; 21.22,35.5 21.22,37.95 N4-2.1 ; 21.22,35.5 v1(20.25,35.5)
  Inner2 w0.254: v1(20.25,35.5) 18.93,35.5 ; 18.93,35.5 18.93,28.12 22.75,28.12 v1(22.75,17) ; 18.93,35.5 18.93,72.57 23.55,72.57 23.55,86.47 24.22,86.47
OUT-2-1: length 29.4
  Top Layer w0.254: P3-1.3 25.79,67 25.79,63 ; 29.22,64.5 29.22,67.95 P7-1.1 ; 29.22,64.5 v1(28.25,64.5) ; 29.22,64.5 29.22,63.95 N7-1.1 ; 25.79,63 25.79,61 ; 25.79,63 N3-1.3 ; 25.79,61 v1(26.75,61) ; 25.79,61 25.79,55 P3-2.3
  Inner1 w0.254: v1(28.25,64.5) 28.25,61 v1(26.75,61)
OUT-2-2: length 102.8
  Top Layer w0.254: P4-1.3 25.79,45 25.79,41 ; 25.79,39 25.79,33 P4-2.3 ; 25.79,39 25.79,41 ; 25.79,39 v1(26.75,39) ; N5-2.1 25.28,81.95 25.28,79.5 ; 25.28,79.5 25.28,77.95 P5-2.1 ; 25.28,79.5 v1(24.25,79.5) ; 25.79,41 N4-1.3 ; P6-2.1 25.28,11.95 25.28,13.5 ; N6-2.1 25.28,15.95 25.28,13.5 ; 25.28,13.5 v1(24.25,13.5)
  Inner1 w0.254: v1(24.25,13.5) 26.75,13.5 v1(26.75,39) 24.25,39 v1(24.25,79.5)
OUT-3-1: length 108.2
  Top Layer w0.254: v1(52.25,42.5) 53.22,42.5 ; 53.22,42.5 53.22,41.95 N20-1.1 ; 53.22,42.5 53.22,45.95 P20-1.1 ; v1(28.25,42.5) 29.22,42.5 ; 29.22,42.5 29.22,41.95 N8-1.1 ; 29.22,42.5 29.22,45.95 P8-1.1 ; N5-1.3 29.72,85 ; 29.72,85 29.72,89 P5-1.3 ; 29.72,85 29.72,83 ; v1(30.75,83) 29.72,83 ; 29.72,83 29.72,77 P5-2.3 ; v1(28.25,57.5) 29.22,57.5 ; 29.22,57.5 29.22,59.95 N7-2.1 ; 29.22,57.5 29.22,55.95 P7-2.1
  Inner2 w0.254: v1(52.25,42.5) 52.25,44.42 28.25,44.42 ; 28.25,44.42 v1(28.25,42.5) ; 28.25,44.42 v1(28.25,57.5) 30.75,57.5 v1(30.75,83)
OUT-3-2: length 137.7
  Top Layer w0.254: v1(48.25,13.5) 49.28,13.5 ; 49.28,13.5 49.28,11.95 P18-2.1 ; 49.28,13.5 49.28,15.95 N18-2.1 ; v1(30.75,17) 29.72,17 ; 29.72,17 29.72,11 P6-2.3 ; 29.72,17 29.72,19 ; 29.22,35.5 29.22,37.95 N8-2.1 ; 29.22,35.5 29.22,33.95 P8-2.1 ; 29.22,35.5 v1(28.25,35.5) ; 29.72,19 29.72,23 P6-1.3 ; 29.72,19 N6-1.3 ; P9-1.1 33.28,89.95 33.28,86.5 ; v1(32.25,86.5) 33.28,86.5 ; 33.28,86.5 33.28,85.95 N9-1.1
  Inner1 w0.254: 29.72,35.5 29.72,17 v1(30.75,17) ; 29.72,35.5 v1(28.25,35.5) ; 29.72,35.5 29.72,86.5 v1(32.25,86.5)
  Inner2 w0.254: v1(48.25,13.5) 48.25,11.99 30.75,11.99 v1(30.75,17)
OUT-4-1: length 104.5
  Top Layer w0.254: v1(56.25,13.5) 57.28,13.5 ; 57.28,13.5 57.28,11.95 P22-2.1 ; 57.28,13.5 57.28,15.95 N22-2.1 ; 41.28,20.5 41.28,19.95 N14-1.1 ; 41.28,20.5 41.28,23.95 P14-1.1 ; 41.28,20.5 v1(40.25,20.5) ; 33.79,63 33.79,61 ; 33.79,63 N7-1.3 ; 33.79,63 33.79,67 P7-1.3 ; 33.79,61 33.79,55 P7-2.3 ; 33.79,61 v1(34.75,61)
  Inner1 w0.254: 39.5,20.5 39.5,11.99 56.25,11.99 v1(56.25,13.5) ; 39.5,20.5 39.5,27.27 39.47,27.3 35.49,27.3 35.49,61 v1(34.75,61) ; 39.5,20.5 v1(40.25,20.5)
OUT-4-2: length 116.9
  Top Layer w0.254: N8-1.3 33.79,41 ; 33.79,41 33.79,45 P8-1.3 ; 33.79,41 33.79,39 ; 49.28,86.5 49.28,89.95 P17-1.1 ; 49.28,86.5 v1(48.25,86.5) ; 49.28,86.5 49.28,85.95 N17-1.1 ; v1(34.75,39) 33.79,39 ; 33.79,39 33.79,33 P8-2.3 ; v1(32.25,20.5) 33.28,20.5 ; 33.28,20.5 33.28,23.95 P10-1.1 ; 33.28,20.5 33.28,19.95 N10-1.1
  Inner1 w0.254: v1(32.25,20.5) 33.79,20.5 33.79,39 ; v1(34.75,39) 33.79,39 ; 33.79,39 33.79,87.61 48.25,87.61 v1(48.25,86.5)
OUT-4-3: length 57.7
  Top Layer w0.254: 37.22,64.5 37.22,63.95 N11-1.1 ; 37.22,64.5 v1(36.25,64.5) ; 37.22,64.5 37.22,67.95 P11-1.1 ; P13-2.1 41.28,77.95 41.28,79.5 ; 37.73,85 37.73,89 P9-1.3 ; 37.73,85 N9-1.3 ; 37.73,85 37.73,83 ; 41.28,79.5 41.28,81.95 N13-2.1 ; 41.28,79.5 v1(40.25,79.5) ; v1(38.75,83) 37.73,83 ; 37.73,83 37.73,77 P9-2.3
  Inner1 w0.254: v1(36.25,64.5) 36.25,83 v1(38.75,83) 40.25,83 v1(40.25,79.5)
OUT-5-1: length 78.2
  Top Layer w0.254: N19-2.1 53.22,59.95 53.22,57.5 ; 53.22,57.5 53.22,55.95 P19-2.1 ; 53.22,57.5 v1(52.25,57.5) ; 37.73,19 37.73,23 P10-1.3 ; 37.73,19 N10-1.3 ; 37.73,19 37.73,17 ; 37.73,17 37.73,11 P10-2.3 ; 37.73,17 v1(38.75,17)
  Inner3 w0.254: v1(52.25,57.5) 49.79,57.5 49.79,18.09 38.75,18.09 v1(38.75,17)
OUT-5-2: length 84.9
  Top Layer w0.254: 41.79,63 41.79,67 P11-1.3 ; 41.79,63 41.79,61 ; 41.79,63 N11-1.3 ; v1(36.25,42.5) 37.22,42.5 ; 37.22,42.5 37.22,41.95 N12-1.1 ; 37.22,42.5 37.22,45.95 P12-1.1 ; P13-1.1 41.28,89.95 41.28,86.5 ; 41.79,61 v1(42.75,61) ; 41.79,61 41.79,55 P11-2.3 ; 41.28,86.5 v1(40.25,86.5) ; 41.28,86.5 41.28,85.95 N13-1.1
  Inner1 w0.254: v1(36.25,42.5) 42.75,42.5 v1(42.75,61) 42.77,61.02 42.77,86.5 v1(40.25,86.5)
OUT-6-1: length 79.8
  Top Layer w0.254: 41.79,41 41.79,45 P12-1.3 ; 41.79,41 N12-1.3 ; 41.79,41 41.79,39 ; 41.28,13.5 41.28,11.95 P14-2.1 ; 41.28,13.5 41.28,15.95 N14-2.1 ; 41.28,13.5 v1(40.25,13.5) ; v1(42.75,39) 41.79,39 ; 41.79,39 41.79,33 P12-2.3 ; 45.22,57.5 45.22,59.95 N15-2.1 ; 45.22,57.5 45.22,55.95 P15-2.1 ; 45.22,57.5 v1(44.25,57.5)
  Inner1 w0.254: v1(40.25,13.5) 42.75,13.5 v1(42.75,39)
  Inner3 w0.254: v1(42.75,39) 42.75,57.5 v1(44.25,57.5)
OUT-6-2: length 45.2
  Top Layer w0.254: v1(46.75,83) 45.73,83 ; 45.73,83 45.73,85 ; 45.73,83 45.73,77 P13-2.3 ; 45.73,85 45.73,89 P13-1.3 ; 45.73,85 N13-1.3 ; 45.22,64.5 45.22,63.95 N15-1.1 ; 45.22,64.5 v1(44.25,64.5) ; 45.22,64.5 45.22,67.95 P15-1.1
  Inner1 w0.254: v1(46.75,83) 46.75,64.5 v1(44.25,64.5)
OUT-7-1: length 134.4
  Top Layer w0.254: N27-1.1 69.22,63.95 69.22,64.5 ; N18-1.1 49.28,19.95 49.28,20.5 ; v1(68.25,64.5) 69.22,64.5 ; 69.22,64.5 69.22,67.95 P27-1.1 ; N14-1.3 45.73,19 ; 45.73,19 45.73,17 ; 45.73,19 45.73,23 P14-1.3 ; 49.28,20.5 49.28,23.95 P18-1.1 ; 49.28,20.5 v1(48.25,20.5) ; 57.28,79.5 57.28,77.95 P21-2.1 ; 57.28,79.5 v1(56.25,79.5) ; 57.28,79.5 57.28,81.95 N21-2.1 ; 45.73,17 45.73,11 P14-2.3 ; 45.73,17 v1(46.75,17)
  Inner2 w0.254: v1(56.25,79.5) 56.25,71.42 67.52,71.42 67.52,64.44 ; v1(46.75,17) 48.25,17 v1(48.25,20.5) 48.25,25.69 48.27,25.71 67.52,25.71 67.52,64.44 ; 67.52,64.44 68.19,64.44 v1(68.25,64.5)
OUT-7-2: length 103.4
  Top Layer w0.254: v1(60.25,57.5) 61.22,57.5 ; 61.22,57.5 61.22,55.95 P23-2.1 ; 61.22,57.5 61.22,59.95 N23-2.1 ; 49.28,79.5 49.28,77.95 P17-2.1 ; 49.28,79.5 49.28,81.95 N17-2.1 ; 49.28,79.5 v1(48.25,79.5) ; 49.79,61 49.79,55 P15-2.3 ; 49.79,61 49.79,63 ; 49.79,61 v1(50.75,61) ; 49.79,63 N15-1.3 ; 49.79,63 49.79,67 P15-1.3 ; P16-2.1 45.22,33.95 45.22,35.5 ; 45.22,35.5 45.22,37.95 N16-2.1 ; 45.22,35.5 v1(44.25,35.5)
  Inner1 w0.254: 48.25,55.93 60.26,55.93 60.26,57.49 v1(60.25,57.5) ; 48.25,55.93 48.25,35.5 v1(44.25,35.5) ; 48.25,55.93 48.25,61 ; v1(50.75,61) 48.25,61 ; 48.25,61 v1(48.25,79.5)
OUT-8-1: length 53.3
  Top Layer w0.254: P16-1.3 49.79,45 49.79,41 ; N19-1.1 53.22,63.95 53.22,64.5 ; v1(52.25,64.5) 53.22,64.5 ; 53.22,64.5 53.22,67.95 P19-1.1 ; v1(50.75,39) 49.79,39 ; 49.79,39 49.79,33 P16-2.3 ; 49.79,39 49.79,41 ; N16-1.3 49.79,41
  Inner3 w0.254: v1(50.75,39) 53.22,39 53.22,64.5 v1(52.25,64.5)
OUT-8-2: length 67.5
  Top Layer w0.254: P17-1.3 53.73,89 53.73,85 ; 53.73,85 53.73,83 ; 53.73,85 N17-1.3 ; 53.73,83 v1(54.75,83) ; 53.73,83 53.73,77 P17-2.3 ; v1(83.5,65) R14.2
  Inner3 w0.254: v1(54.75,83) 54.75,84.12 80.65,84.12 80.65,65 v1(83.5,65)
OUT-8-3: length 58.3
  Top Layer w0.254: 53.73,19 53.73,23 P18-1.3 ; 53.73,19 N18-1.3 ; 53.73,19 53.73,17 ; 53.22,35.5 53.22,33.95 P20-2.1 ; 53.22,35.5 53.22,37.95 N20-2.1 ; 53.22,35.5 v1(52.25,35.5) ; P18-2.3 53.73,11 53.73,17 ; N24-2.1 61.22,37.95 61.22,35.5 ; 53.73,17 v1(54.75,17) ; P24-2.1 61.22,33.95 61.22,35.5 ; 61.22,35.5 v1(60.25,35.5)
  Inner1 w0.254: v1(60.25,35.5) 54.75,35.5 ; 54.75,35.5 v1(52.25,35.5) ; 54.75,35.5 v1(54.75,17)
OUT-9-1: length 102.8
  Top Layer w0.254: P19-2.3 57.79,55 57.79,61 ; P19-1.3 57.79,67 57.79,63 ; v1(56.25,86.5) 57.28,86.5 ; 57.28,86.5 57.28,89.95 P21-1.1 ; 57.28,86.5 57.28,85.95 N21-1.1 ; 57.79,61 57.79,63 ; 57.79,61 v1(58.75,61) ; N19-1.3 57.79,63 ; v1(56.25,20.5) 57.28,20.5 ; 57.28,20.5 57.28,19.95 N22-1.1 ; 57.28,20.5 57.28,23.95 P22-1.1
  Inner1 w0.254: v1(56.25,86.5) 58.75,86.5 v1(58.75,61)
  Inner3 w0.254: v1(56.25,20.5) 57.79,20.5 57.79,61 v1(58.75,61)
OUT-9-2: length 58.4
  Top Layer w0.254: v1(58.75,39) 57.79,39 ; 57.79,39 57.79,41 ; 57.79,39 57.79,33 P20-2.3 ; P20-1.3 57.79,45 57.79,41 ; N30-1.1 73.29,19.95 73.29,20.5 ; 57.79,41 N20-1.3 ; 73.29,20.5 v1(72.25,20.5) ; 73.29,20.5 73.29,23.95 P30-1.1
  Inner3 w0.254: v1(72.25,20.5) 72.25,40.06 58.75,40.06 v1(58.75,39)
OUT-10-1: length 98.6
  Top Layer w0.254: 62.75,82.98 61.73,82.98 ; 61.73,82.98 61.73,77 P21-2.3 ; 61.73,82.98 61.73,85 ; N21-1.3 61.73,85 ; 61.73,85 61.73,89 P21-1.3 ; v1(91,35) R8.1
  Inner2 w0.254: v1(91,35) 91,33.07 76.72,33.07 76.72,73.71 62.75,73.71 62.75,83 v1(62.75,83)
OUT-10-2: length 115.2
  Top Layer w0.254: 61.73,19 61.73,23 P22-1.3 ; 61.73,19 61.73,17 ; 61.73,19 N22-1.3 ; P22-2.3 61.73,11 61.73,17 ; N23-1.1 61.22,63.95 61.22,64.5 ; 65.28,86.5 65.28,89.95 P25-1.1 ; 65.28,86.5 65.28,85.95 N25-1.1 ; 65.28,86.5 v1(64.25,86.5) ; N24-1.1 61.22,41.95 61.22,42.5 ; P23-1.1 61.22,67.95 61.22,64.5 ; 61.22,64.5 v1(60.25,64.5) ; 61.73,17 v1(62.75,17) ; 61.22,42.5 v1(60.25,42.5) ; 61.22,42.5 61.22,45.95 P24-1.1
  Inner1 w0.254: v1(60.25,64.5) 61.22,64.5 ; 61.22,64.5 61.22,86.5 v1(64.25,86.5) ; 61.22,64.5 61.22,42.5 ; 61.22,42.5 61.22,17 v1(62.75,17) ; 61.22,42.5 v1(60.25,42.5)
OUT-11-1: length 56.4
  Top Layer w0.254: 65.79,63 65.79,67 P23-1.3 ; 65.79,63 N23-1.3 ; 65.79,63 65.79,61 ; N27-2.1 69.22,59.95 69.22,57.5 ; P23-2.3 65.79,55 65.79,61 ; 69.22,57.5 69.22,55.95 P27-2.1 ; 69.22,57.5 v1(68.25,57.5) ; 65.79,61 v1(66.75,61) ; v1(86,65) R13.2
  Inner1 w0.254: v1(66.75,61) 68.25,61 v1(68.25,57.5)
  Inner3 w0.254: v1(68.25,57.5) 86,57.5 v1(86,65)
OUT-11-2: length 91.8
  Top Layer w0.254: v1(66.75,39) 65.79,39 ; 65.79,39 65.79,41 ; 65.79,39 65.79,33 P24-2.3 ; 69.22,42.5 69.22,45.95 P28-1.1 ; 69.22,42.5 69.22,41.95 N28-1.1 ; 69.22,42.5 v1(68.25,42.5) ; 65.79,41 65.79,45 P24-1.3 ; 65.79,41 N24-1.3 ; P26-2.1 65.28,11.95 65.28,13.5 ; v1(86,35) R6.1 ; N26-2.1 65.28,15.95 65.28,13.5 ; 65.28,13.5 v1(64.25,13.5)
  Inner1 w0.254: v1(68.25,42.5) 66.75,42.5 v1(66.75,39) 66.75,13.5 v1(64.25,13.5)
  Inner3 w0.254: v1(86,35) 86,42.5 v1(68.25,42.5)
OUT-11-3: length 83.5
  Top Layer w0.254: 69.22,35.5 69.22,33.95 P28-2.1 ; 69.22,35.5 v1(68.25,35.5) ; 69.22,35.5 69.22,37.95 N28-2.1 ; 69.86,85 69.86,89 P25-1.3 ; 69.86,85 N25-1.3 ; 69.86,85 69.86,83 ; v1(72.25,79.5) 73.29,79.5 ; 73.29,79.5 73.29,81.95 N29-2.1 ; 73.29,79.5 73.29,77.95 P29-2.1 ; P25-2.3 69.86,77 69.86,83 ; 69.86,83 v1(70.75,83)
  Inner1 w0.254: v1(70.75,83) 70.75,79.5 ; 70.75,79.5 v1(72.25,79.5) ; 70.75,79.5 70.75,35.5 v1(68.25,35.5)
OUT-12-1: length 97.2
  Top Layer w0.254: 73.29,86.5 73.29,89.95 P29-1.1 ; 73.29,86.5 73.29,85.95 N29-1.1 ; 73.29,86.5 v1(72.25,86.5) ; 69.73,19 69.73,17 ; 69.73,19 69.73,23 P26-1.3 ; 69.73,19 N26-1.3 ; 69.73,17 v1(70.75,17) ; 69.73,17 69.73,11 P26-2.3
  Inner1 w0.254: v1(70.75,17) 73.29,17 73.29,86.5 v1(72.25,86.5)
OUT-12-2: length 45
  Top Layer w0.254: 73.67,61 73.67,55 P27-2.3 ; 73.67,61 v1(74.75,61) ; 73.67,61 73.67,63 ; v1(93.5,65) R10.2 ; N27-1.3 73.67,63 ; 73.67,63 73.67,67 P27-1.3
  Inner1 w0.254: v1(93.5,65) 93.5,66.98 74.75,66.98 v1(74.75,61)
OUT-12-3: length 52
  Top Layer w0.254: v1(74.75,39) 73.67,39 ; 73.67,39 73.67,41 ; 73.67,39 73.67,33 P28-2.3 ; P28-1.3 73.67,45 73.67,41 ; 73.29,13.5 73.29,11.95 P30-2.1 ; 73.29,13.5 v1(72.25,13.5) ; 73.29,13.5 73.29,15.95 N30-2.1 ; 73.67,41 N28-1.3
  Inner2 w0.254: v1(74.75,39) 74.75,13.5 v1(72.25,13.5)
OUT-13-1: length 71.5
  Top Layer w0.254: v1(78.75,83) 77.86,83 ; 77.86,83 77.86,77 P29-2.3 ; 77.86,83 77.86,85 ; N29-1.3 77.86,85 ; 77.86,85 77.86,89 P29-1.3 ; v1(83.5,35) R5.1
  Inner2 w0.254: v1(78.75,83) 78.75,35 v1(83.5,35)
OUT-13-2: length 78.7
  Top Layer w0.254: P30-2.3 77.73,11 77.73,17 ; N30-1.3 77.73,19 ; 77.73,19 77.73,23 P30-1.3 ; 77.73,19 77.73,17 ; 77.73,17 v1(78.75,17) ; R11.2 v1(91,65)
  Inner1 w0.254: v1(91,65) 91,61.01 79.51,61.01 79.51,17 v1(78.75,17)
P: length 2.9
  Top Layer w0.254: U2.5 93.5,41.02 R9.2
TP1: length 102
  Top Layer w0.254: 7.25,83 v1(8.25,83) ; v1(83.75,84.26) U1.1
  Inner2 w0.254: v1(83.75,84.26) 83.75,95.43 8.25,95.43 v1(8.25,83)
TP2: length 123.4
  Top Layer w0.254: v1(8.25,61) 8.24,61.01 7.25,61.01 ; v1(84.25,83.61) U1.2
  Inner2 w0.254: v1(8.25,61) 8.88,61 8.88,94.79 83.17,94.79 83.17,83.61 v1(84.25,83.61)
TP3: length 144.8
  Top Layer w0.254: v1(83.75,82.96) U1.3 ; v1(8.25,39) 8.21,39.04 7.25,39.04
  Inner2 w0.254: v1(83.75,82.96) 82.56,82.96 82.56,94.16 9.5,94.16 9.5,39 v1(8.25,39)
TP4: length 166.1
  Top Layer w0.254: v1(84.25,82.31) U1.4 ; v1(8.25,17) 7.25,17
  Inner2 w0.254: v1(8.25,17) 10.12,17 10.12,93.52 81.92,93.52 81.92,82.35 84.21,82.35 v1(84.25,82.31)

## Copper pours and planes (outline as drawn; the poured copper is in the pictures)
TP1 on Top Layer: 0,90.5 7.5,90.5 7.5,75.5 0,75.5
TP2 on Top Layer: 0,68.5 7.5,68.5 7.5,53.5 0,53.5
TP3 on Top Layer: 0,46.5 7.5,46.5 7.5,31.5 0,31.5
TP4 on Top Layer: 0,24.5 7.5,24.5 7.5,9.5 0,9.5
